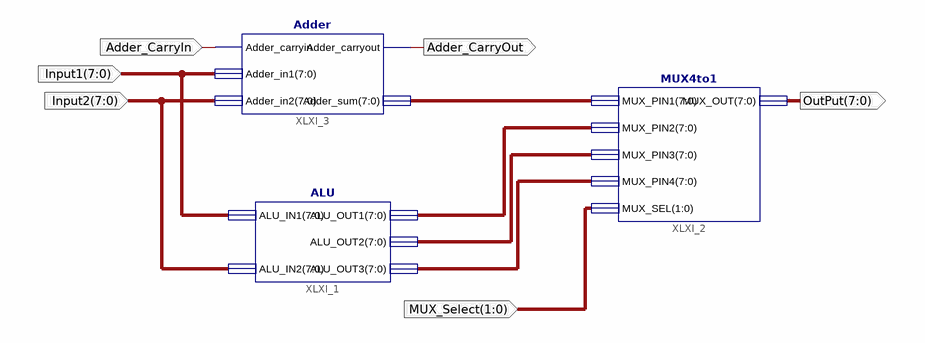
[diagram p0: schematic sheet 1]
// Xilinx ISE schematic ALU_T.sch (spartan3e) as structural Verilog: 3 symbols, 6 ports
module ALU_T (
  input  [1:0] MUX_Select,
  input  Adder_CarryIn,
  input  [7:0] Input1,
  input  [7:0] Input2,
  output Adder_CarryOut,
  output [7:0] OutPut
);

  wire [7:0] XLXN_1, XLXN_2, XLXN_3, XLXN_4;

  ALU XLXI_1 (.ALU_IN1(Input1), .ALU_IN2(Input2), .ALU_OUT1(XLXN_2), .ALU_OUT2(XLXN_3), .ALU_OUT3(XLXN_4));
  MUX4to1 XLXI_2 (
    .MUX_PIN1(XLXN_1), .MUX_PIN2(XLXN_2), .MUX_PIN3(XLXN_3), .MUX_PIN4(XLXN_4), .MUX_SEL(MUX_Select),
    .MUX_OUT(OutPut));
  Adder XLXI_3 (
    .Adder_carryin(Adder_CarryIn), .Adder_in1(Input1), .Adder_in2(Input2), .Adder_carryout(Adder_CarryOut),
    .Adder_sum(XLXN_1));
endmodule
